# EAGLE schematic Power PCB_v1 (EAGLE 9.6.2)
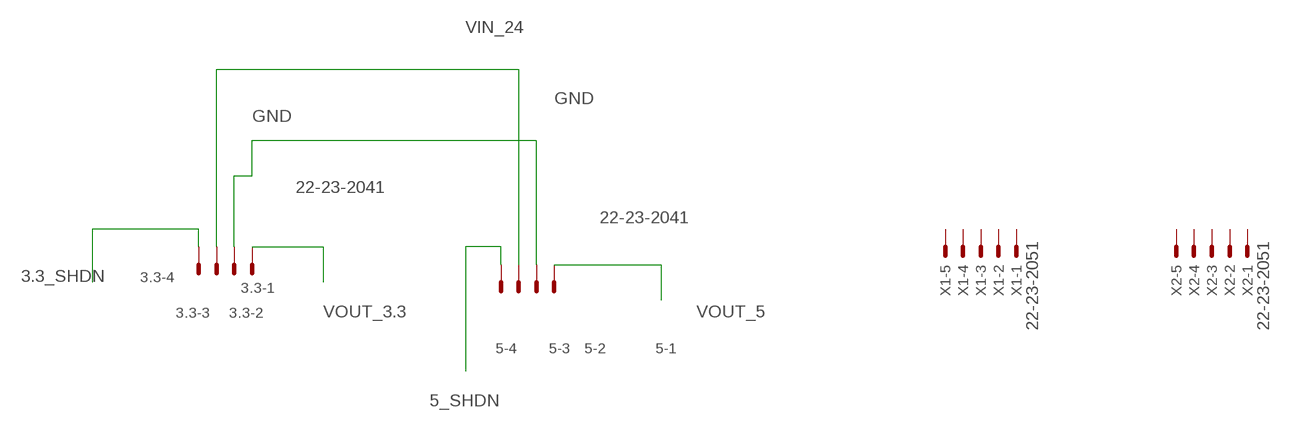
[diagram p0: schematic, sheet 1]

## Parts
3.3  22-23-2041  [22-23-2041]
5  22-23-2041  [22-23-2041]
X1  22-23-2051  [22-23-2051]
X2  22-23-2051  [22-23-2051]

## Nets
3.3_SHDN: 3.3.4
5_SHDN: 5.4
GND: 3.3.2 5.2
VIN_24: 3.3.3 5.3
VOUT_3.3: 3.3.1
VOUT_5: 5.1
Unconnected: X1.1 X1.2 X1.3 X1.4 X1.5 X2.1 X2.2 X2.3 X2.4 X2.5

## Library data of the parts
3.3 5 = con-molex:22-23-2041: .100" (2.54mm) Center Header - 4 Pin; MF: MOLEX; MPN: 22-23-2041; OC_FARNELL: 1462920; OC_NEWARK: 38C0355
X1 X2 = con-molex:22-23-2051: .100" (2.54mm) Center Header - 5 Pin; MF: MOLEX; MPN: 22-23-2051; OC_FARNELL: 1462952; OC_NEWARK: 38C9178